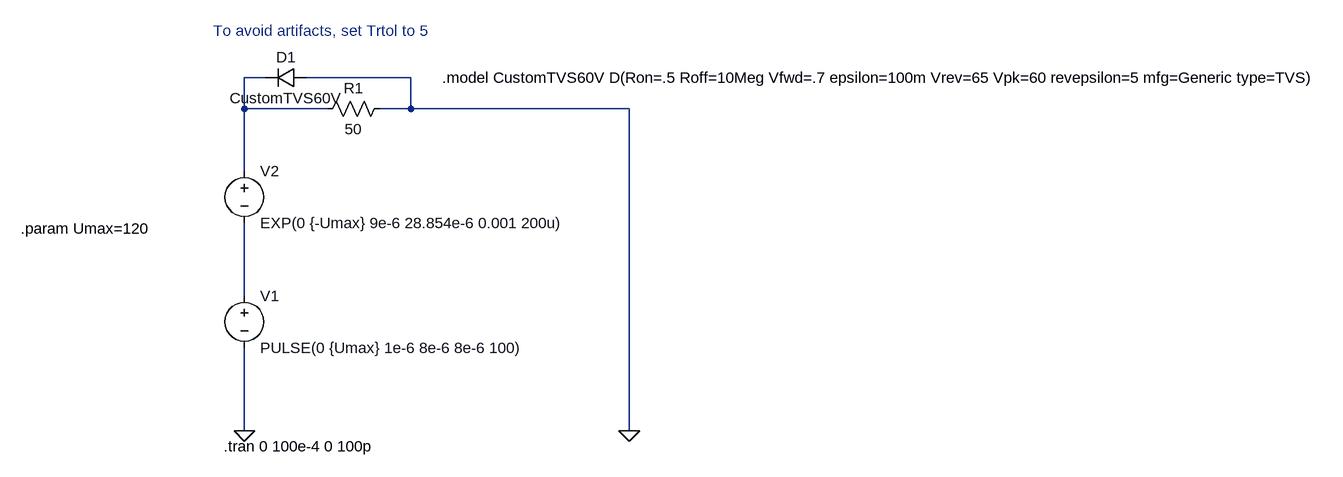
[diagram p0: schematic example1.asc]
example1.asc, the LTspice schematic file:
Version 4
SHEET 1 1600 680
WIRE -32 -272 -64 -272
WIRE 192 -272 32 -272
WIRE -64 -224 -64 -272
WIRE 64 -224 -64 -224
WIRE 192 -224 192 -272
WIRE 192 -224 144 -224
WIRE 528 -224 192 -224
WIRE -64 -128 -64 -224
WIRE -64 64 -64 -48
WIRE -64 272 -64 144
WIRE 528 272 528 -224
FLAG -64 272 0
FLAG 528 272 0
SYMBOL voltage -64 48 R0
WINDOW 123 0 0 Left 0
WINDOW 39 0 0 Left 0
SYMATTR InstName V1
SYMATTR Value PULSE(0 {Umax} 1e-6 8e-6 8e-6 100)
SYMBOL voltage -64 -144 R0
WINDOW 123 0 0 Left 0
WINDOW 39 0 0 Left 0
SYMATTR InstName V2
SYMATTR Value EXP(0 {-Umax} 9e-6 28.854e-6 0.001 200u)
SYMBOL res 160 -240 R90
WINDOW 0 0 56 VBottom 2
WINDOW 3 32 56 VTop 2
SYMATTR InstName R1
SYMATTR Value 50
SYMBOL diode 32 -288 R90
WINDOW 0 0 32 VBottom 2
WINDOW 3 32 32 VTop 2
SYMATTR InstName D1
SYMATTR Value CustomTVS60V
TEXT -96 296 Left 2 !.tran 0 100e-4 0 100p
TEXT -408 -40 Left 2 !.param Umax=120
TEXT -112 -344 Left 2 ;To avoid artifacts, set Trtol to 5
TEXT 240 -272 Left 2 !.model CustomTVS60V D(Ron=.5 Roff=10Meg Vfwd=.7 epsilon=100m Vrev=65 Vpk=60 revepsilon=5 mfg=Generic type=TVS)

The netlist it stands for:
* example1.asc
V1 N002 0 PULSE(0 {Umax} 1e-6 8e-6 8e-6 100)
V2 N001 N002 EXP(0 {-Umax} 9e-6 28.854e-6 0.001 200u)
R1 0 N001 50
D1 0 N001 CustomTVS60V
.model D D
.lib standard.dio
.tran 0 100e-4 0 100p
.param Umax=120
* To avoid artifacts, set Trtol to 5
.model CustomTVS60V D(Ron=.5 Roff=10Meg Vfwd=.7 epsilon=100m Vrev=65 Vpk=60 revepsilon=5 mfg=Generic type=TVS)
.backanno
.end